# EasyEDA Pro project SAM-2.eprj, board WDT_SAM
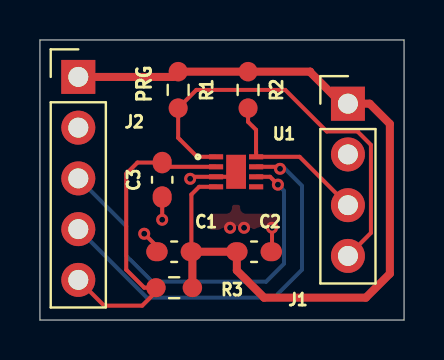
[diagram p18: board, top side]
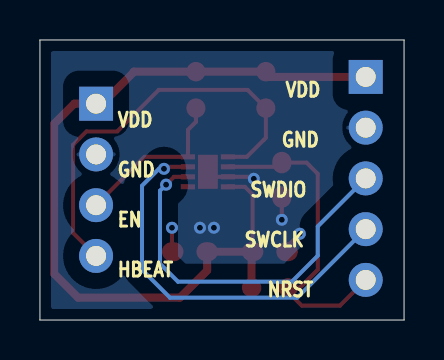
[diagram p19: board, bottom side, seen from below]

Outline 18.23 x 14.02 mm; copper layers: Top Layer, Bottom Layer. Coordinates in mm from the lower left corner of the outline.
Outline path: 0,14.02 18.23,14.02 18.23,0 0,0 0,14.02
Stack: Top Layer 0.035mm / Dielectric1 1.51mm FR4 er 4.5 / Bottom Layer 0.035mm

## Design rules (mm)
spacing safeClearance (default): track to track 0.15, other pairs 0.15 to 0.5
track width trackWidth (default): min 0.127, default 0.254, max 2.54
differential pair differentialPair (default): width min 0.127, default 0.254, max 2.54; gap min 0.152, default 0.152
via viaSize (default): diameter min 0.5, default 0.61, max 10; hole min 0.3, default 0.305, max 6
net GND uses CopperRegion1
pour ie179 uses CopperRegion
pour ie180 uses CopperRegion1

## Placement (name value [footprint] x y rotation side)
C1  100nF  [Capacitor_SMD:C_0603_1608Metric_Pad1.08x0.95mm_HandSolder]  6.72 3.42 180 top
C2  2.2uF  [Capacitor_SMD:C_0603_1608Metric_Pad1.08x0.95mm_HandSolder]  10.72 3.42 0 top
C3  100nF  [Capacitor_SMD:C_0603_1608Metric_Pad1.08x0.95mm_HandSolder]  6.12 7.02 90 top
J1  Conn_01x04_Pin  [Connector_PinHeader_2.54mm:PinHeader_1x04_P2.54mm_Vertical]  15.42 10.83 0 top
J2  Conn_01x05_Pin  [Connector_PinHeader_2.54mm:PinHeader_1x05_P2.54mm_Vertical]  1.92 12.17 0 top
R1  33K  [Resistor_SMD:R_0603_1608Metric_Pad0.98x0.95mm_HandSolder]  6.92 11.52 270 top
R2  33K  [Resistor_SMD:R_0603_1608Metric_Pad0.98x0.95mm_HandSolder]  10.42 11.52 270 top
R3  33K  [Resistor_SMD:R_0603_1608Metric_Pad0.98x0.95mm_HandSolder]  6.72 1.62 180 top
U1  MSPM0C1103SDSGR  [WDT_SAM:DSG0008A_TEX]  9.82 7.42 0 top

## Footprints (pads in the part's own frame, mm; a bottom-side part is the same pattern mirrored in y, then rotated)
Capacitor_SMD:C_0603_1608Metric_Pad1.08x0.95mm_HandSolder
  rrect 1.075x0.95 smd: 1(-0.863,0) 2(0.863,0)
Connector_PinHeader_2.54mm:PinHeader_1x04_P2.54mm_Vertical
  rect 1.7x1.7 hole 1: 1(0,0)
  round 1.7 hole 1: 2(0,-2.54) 3(0,-5.08) 4(0,-7.62)
Connector_PinHeader_2.54mm:PinHeader_1x05_P2.54mm_Vertical
  rect 1.7x1.7 hole 1: 1(0,0)
  round 1.7 hole 1: 2(0,-2.54) 3(0,-5.08) 4(0,-7.62) 5(0,-10.16)
Resistor_SMD:R_0603_1608Metric_Pad0.98x0.95mm_HandSolder
  rrect 0.975x0.95 smd: 1(-0.912,0) 2(0.912,0)
WDT_SAM:DSG0008A_TEX
  rect 0.711x0.254 smd: 1(-1.004,0.75) 2(-1.004,0.25) 3(-1.004,-0.25) 4(-1.004,-0.75) 5(1.004,-0.75) 6(1.004,-0.25) 7(1.004,0.25) 8(1.004,0.75)
  rect 0.991x1.702 smd: 9(0,0)

## Nets
GND: C1.2 C2.2 C3.1 J1.2 J2.2 U1.3 U1.9
VDD: C1.1 C2.1 J1.1 J2.1 R1.1 R2.1 R3.1 U1.4
/ENABLE: J1.3 R2.2 U1.8
/H_BEAT: J1.4 R1.2 U1.1
/NRST: C3.2 J2.5 R3.2 U1.2
/SWCLK: J2.4 U1.7
/SWDIO: J2.3 U1.6
UNCONNECTED-(U1-PA0-PAD5): U1.5

## Via types
v1: diameter 0.6, hole 0.3, Top Layer to Bottom Layer, 8 vias

## Routing (per net, layer and track width the routed paths; a pad name or vN(x,y) marks a point on that pad's centre or on a via; arc(x,y) is an arc through that point)
GND: length 6
  Top Layer w0.2: C1.2 5.86,3.68 v1(5.22,4.32) ; C2.2 11.62,3.46 v1(11.62,4.62) ; U1.9 9.57,7.17 U1.3 7.62,7.17 v1(7.52,7.07) ; C3.1 v1(6.12,5.02)
  vias: v1(9.52,4.62) v1(10.22,4.62)
VDD: length 42.3
  Top Layer w0.2: C1.1 7.58,6.28 7.97,6.67 U1.4
  Top Layer w0.4: J2.1 6.66,12.17 R1.1 13.53,12.43 13.52,12.42 15.11,10.83 J1.1 16.51,10.83 17.52,9.82 17.52,2.32 16.32,1.12 11.22,1.12 9.86,2.48 C2.1 C1.1 7.63,3.37 R3.1
/ENABLE: length 8.2
  Top Layer w0.2: J1.3 13,8.17 U1.8 10.82,8.42 10.82,8.42 10.82,9.52 10.42,9.92 R2.2
/H_BEAT: length 21
  Top Layer w0.2: J1.4 16.57,4.36 16.57,8.77 15.9,9.44 14.36,9.44 12.28,11.52 7.83,11.52 R1.2 6.92,9.12 7.87,8.17 U1.1
/NRST: length 16.4
  Top Layer w0.2: U1.2 6.33,7.67 C3.2 4.88,7.88 4.32,7.32 4.32,2.52 5.22,1.62 R3.2 5.81,1.41 5.12,0.72 3.21,0.72 J2.5
/SWCLK: length 20.1
  Top Layer w0.2: U1.7 11.92,7.67 v1(12.02,7.57)
  Bottom Layer w0.2: v1(12.02,7.57) 12.27,7.57 13.12,6.72 13.12,2.52 11.72,1.12 5.35,1.12 J2.4
/SWDIO: length 19
  Top Layer w0.2: U1.6 11.52,7.17 v1(11.91,6.78)
  Bottom Layer w0.2: J2.3 4.32,4.69 4.32,3.22 5.62,1.92 11.32,1.92 12.22,2.82 12.22,6.47 v1(11.91,6.78)

## Copper pours and planes (outline as drawn; the poured copper is in the pictures)
GND on Top Layer: 9.32,9.12 10.32,9.12 10.32,5.62 12.22,5.62 12.22,4.22 8.02,4.22 8.02,5.62 9.32,5.62
GND on Bottom Layer: 0.02,14.12 18.22,14.12 18.22,0.02 0.02,0.02

## Text on the board
Bottom Silkscreen Layer: VDD | GND | NRST | SWDIO | SWCLK | EN | HBEAT
Top Silkscreen Layer: PRG
